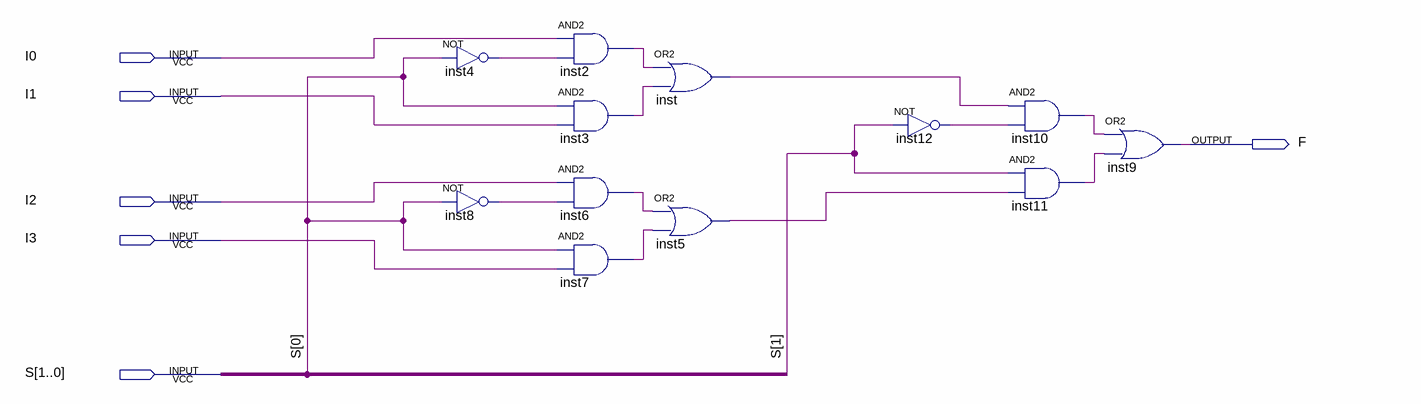
[diagram p0: schematic sheet]
// Quartus schematic 4to1MUX.bdf as structural Verilog: 12 symbols, 6 pins
module \4to1MUX  (
  input  I0,
  input  I1,
  input  I2,
  input  I3,
  input  [1:0] S,
  output F
);

  wire inst2_out, inst3_out, inst4_out, inst5_out, inst6_out, inst7_out, inst8_out, inst10_out, inst11_out,
       inst12_out, inst_out;

  not inst4 (inst4_out, S[0]);
  not inst8 (inst8_out, S[0]);
  and inst2 (inst2_out, I0, inst4_out);
  and inst3 (inst3_out, S[0], I1);
  and inst6 (inst6_out, I2, inst8_out);
  and inst7 (inst7_out, S[0], I3);
  or inst (inst_out, inst2_out, inst3_out);
  or inst5 (inst5_out, inst6_out, inst7_out);
  not inst12 (inst12_out, S[1]);
  and inst10 (inst10_out, inst_out, inst12_out);
  and inst11 (inst11_out, S[1], inst5_out);
  or inst9 (F, inst10_out, inst11_out);
endmodule
